# Altium schematic sheet TELM0004_CurrentSense_BCR.SchDoc: Telemetry Current Sense
size A3; Engineer: A. SHAW; Organization: BLUEsat Project; Address1: Room 419; Address2: School of EE&T; Address3: UNSW, NSW 2052; Address4: Australia; DocumentNumber: TELM0004; SheetNumber: 1; SheetTotal: 1; Description: Converts Current to Voltage 500mV/A; Version: 1.0
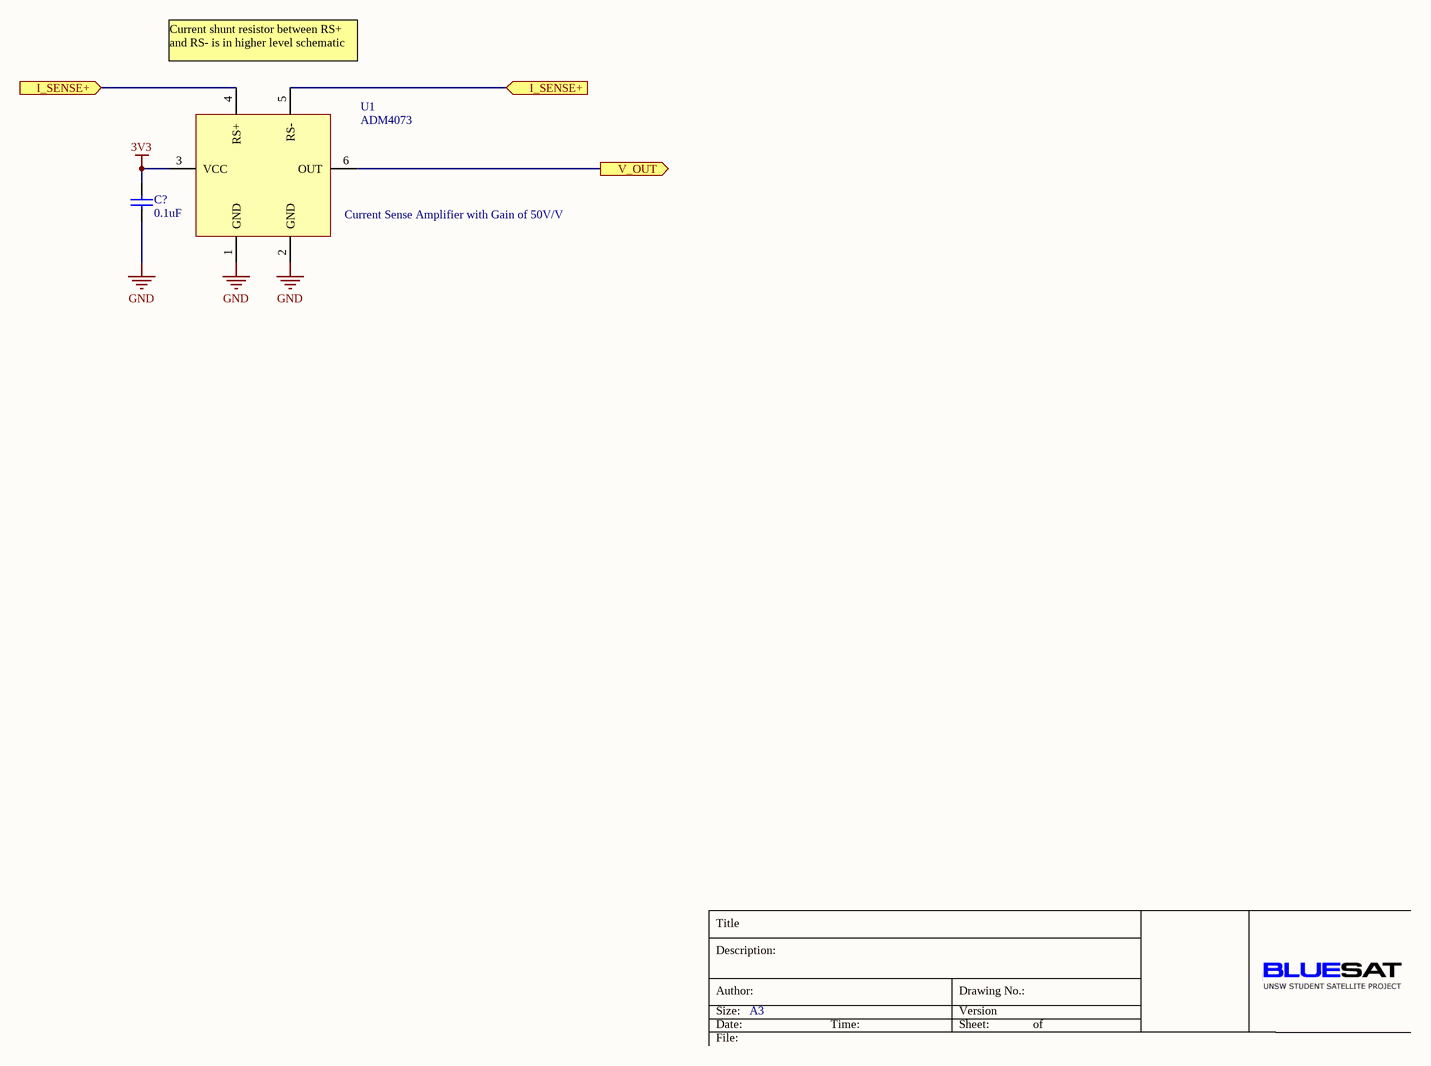
[diagram p0: TELM0004_CurrentSense_BCR.SchDoc]

## Parts
C?  value 0.1uF  [CAPC2012M]  (hidden comment: Cap)
U1  ADM4073  [SOT95P285X145-6N]

## Ports
I_SENSE+ (in), V_OUT (out)

## Nets
3V3: C?.1 U1.3(VCC)
GND: C?.2 U1.1(GND) U1.2(GND)
I_SENSE+: U1.4(RS+) U1.5(RS-) ; port I_SENSE+
V_OUT: U1.6(OUT) ; port V_OUT

## Notes on the sheet
- Current shunt resistor between RS+ and RS- is in higher level schematic
- (near U1) Current Sense Amplifier with Gain of 50V/V
- Title
- Description:
- Size:
- Author:
- Date:
- A3
- Time:
- Version
- Sheet:
- Drawing No.:
- of
- File:

## Library data of the parts
C? = Cap: Capacitor; Published: 8-Jun-2000; LatestRevisionDate: 17-Jul-2002; LatestRevisionNote: Re-released for DXP Platform.; PackageReference: RAD-0.3; Publisher: Altium Limited; PackageDescription: Radial Cap, Thru-Hole; 2 Leads; 0.3 in Pin Spacing; Supplier 1: Farnell; Supplier 2: Farnell; Supplier Part Number 2: 1759265
U1 = ADM4073: Current Sense Amplifer